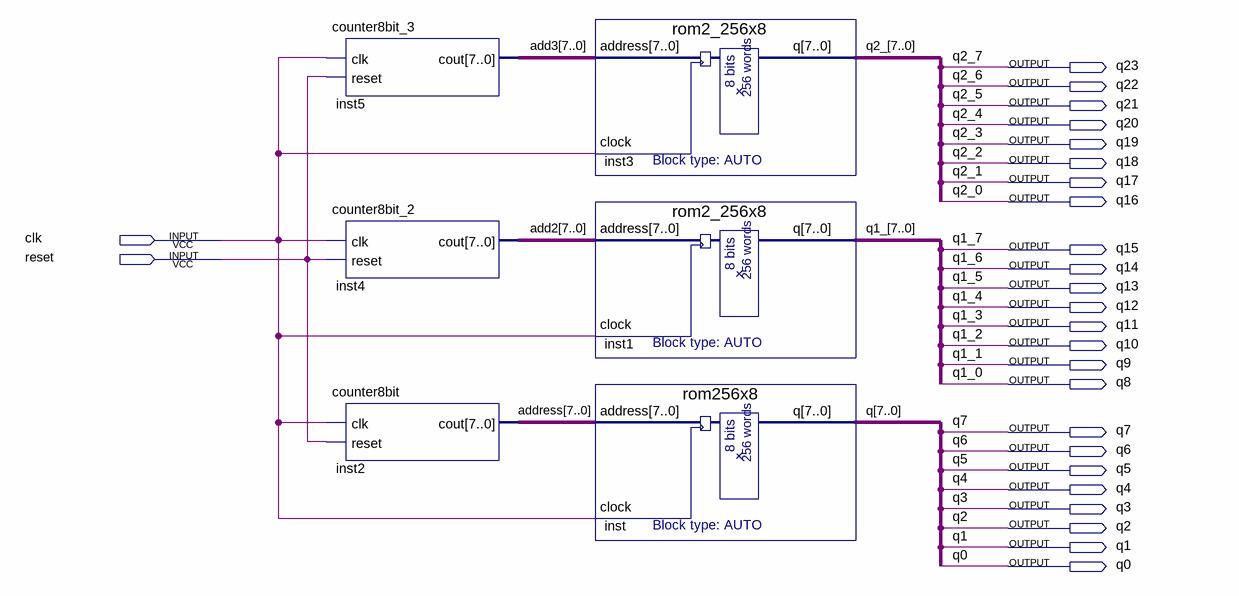
[diagram p0: schematic sheet]
// Quartus schematic memoria.bdf as structural Verilog: 6 symbols, 26 pins
module memoria (
  input  clk,
  input  reset,
  output q23,
  output q22,
  output q21,
  output q20,
  output q19,
  output q18,
  output q17,
  output q16,
  output q15,
  output q14,
  output q13,
  output q12,
  output q11,
  output q10,
  output q9,
  output q8,
  output q7,
  output q6,
  output q5,
  output q4,
  output q3,
  output q2,
  output q1,
  output q0
);

  wire [7:0] add2, add3, address;

  counter8bit_3 inst5 (.clk(clk), .reset(reset), .cout(add3));
  counter8bit_2 inst4 (.clk(clk), .reset(reset), .cout(add2));
  counter8bit inst2 (.clk(clk), .reset(reset), .cout(address));
  rom2_256x8 inst3 (.address(add3), .clock(clk), .q({q23, q22, q21, q20, q19, q18, q17, q16}));
  rom2_256x8 inst1 (.address(add2), .clock(clk), .q({q15, q14, q13, q12, q11, q10, q9, q8}));
  rom256x8 inst (.address(address), .clock(clk), .q({q7, q6, q5, q4, q3, q2, q1, q0}));

  // Other names for the same wires on the sheet: q1_[7:0] = {q15, q14, q13, q12, q11, q10, q9, q8}; q1_0 = q8;
  //   q1_1 = q9; q1_2 = q10; q1_3 = q11; q1_4 = q12; q1_5 = q13; q1_6 = q14; q1_7 = q15;
  //   q2_[7:0] = {q23, q22, q21, q20, q19, q18, q17, q16}; q2_0 = q16; q2_1 = q17; q2_2 = q18; q2_3 = q19; q2_4 = q20;
  //   q2_5 = q21; q2_6 = q22; q2_7 = q23
endmodule
